# Altium schematic sheet 3_MCU.SchDoc
size B; SheetNumber: 3; SheetTotal: 6
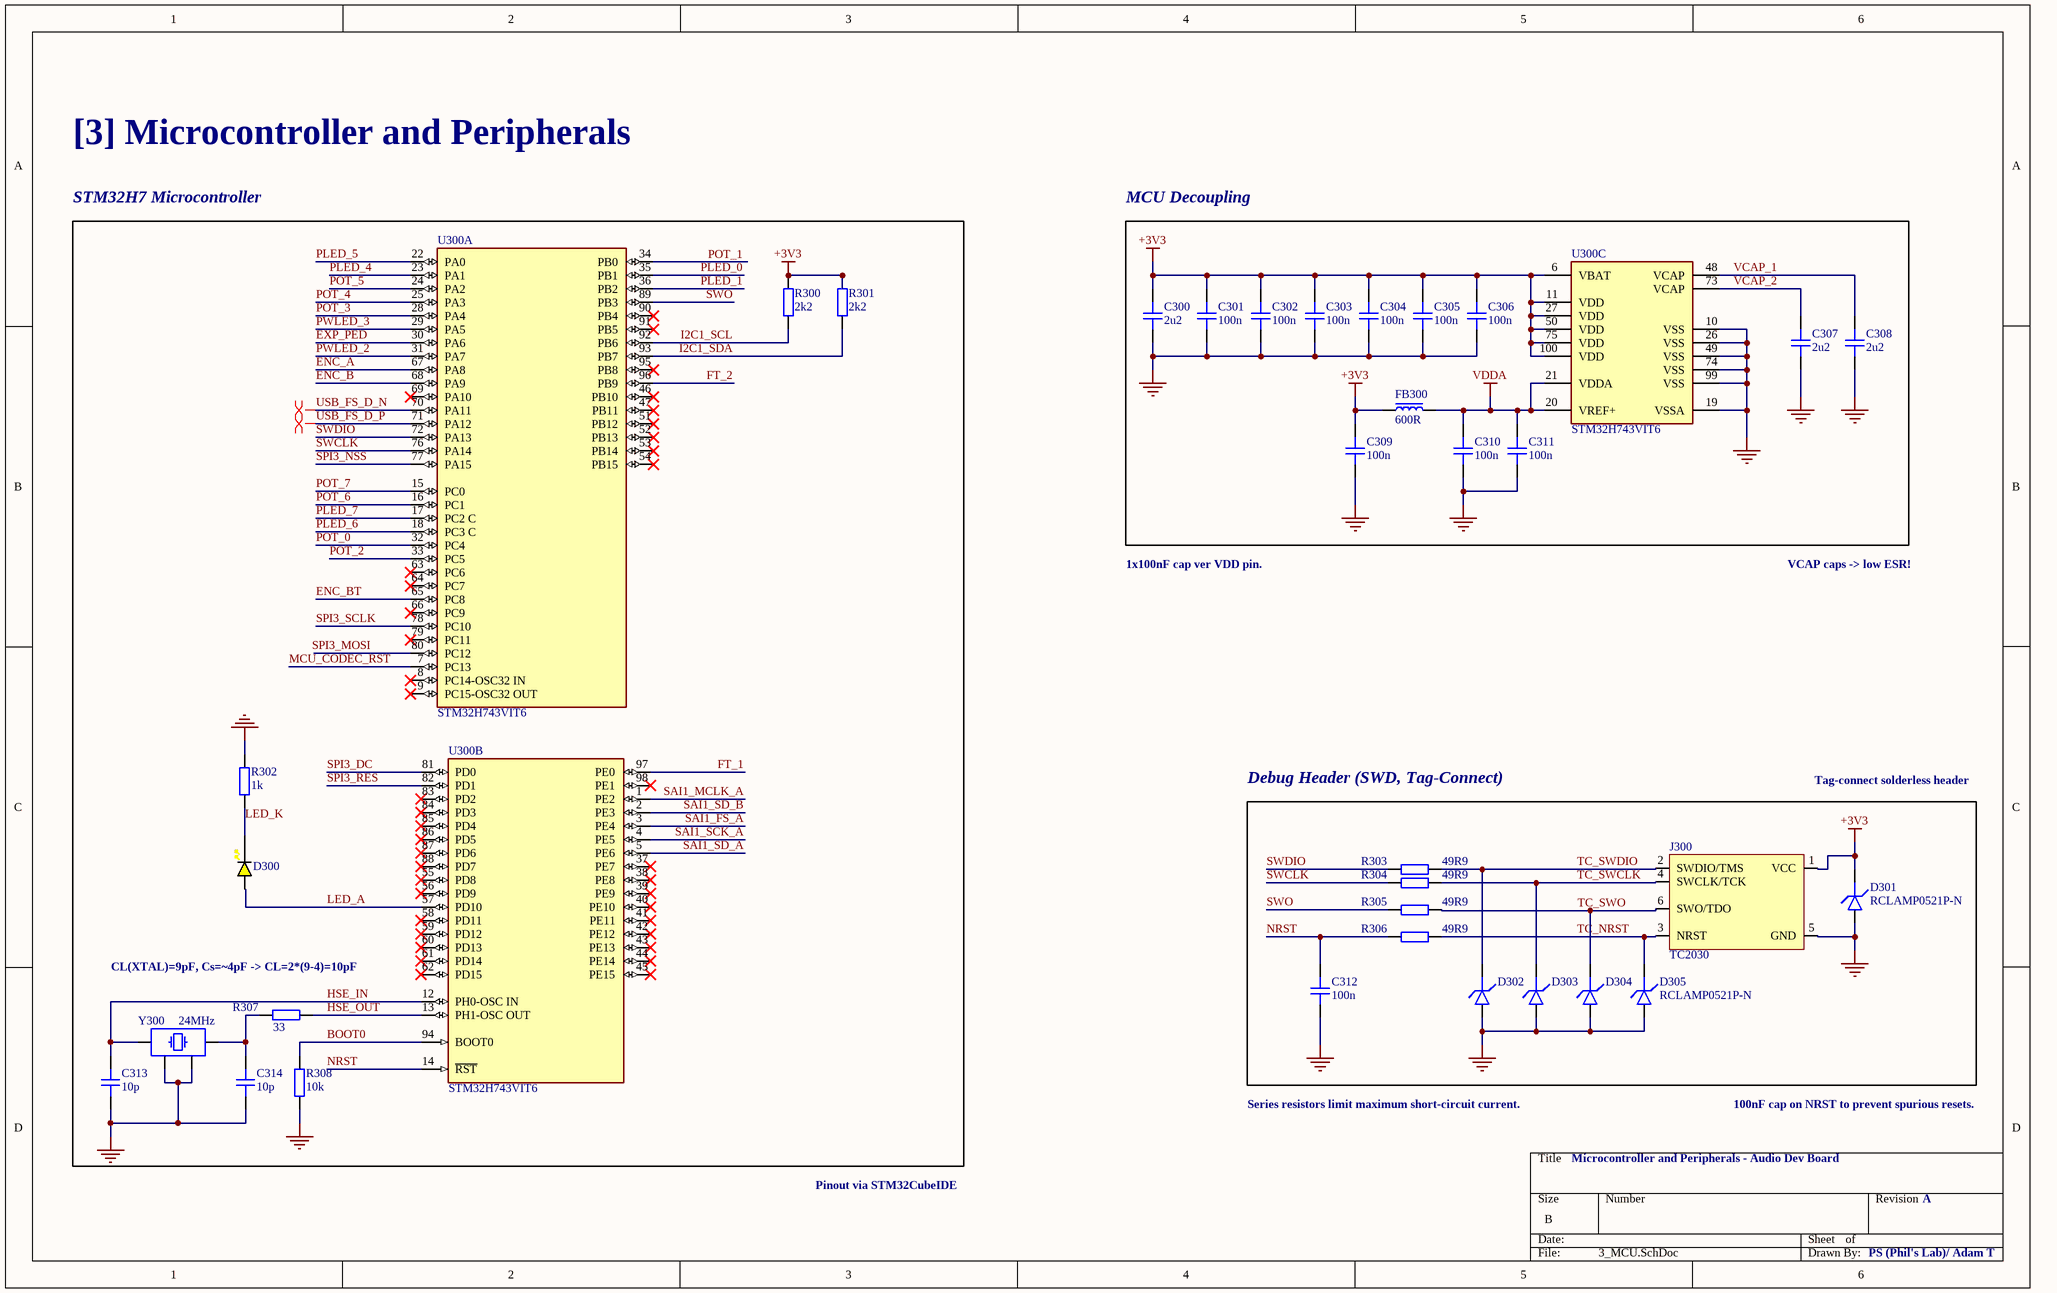
[diagram p0: 3_MCU.SchDoc]

## Parts
C300  2u2  [CAP_0603]
C301  100n  [CAP_0402]
C302  100n  [CAP_0402]
C303  100n  [CAP_0402]
C304  100n  [CAP_0402]
C305  100n  [CAP_0402]
C306  100n  [CAP_0402]
C307  2u2  [CAP_0402]
C308  2u2  [CAP_0402]
C309  100n  [CAP_0402]
C310  100n  [CAP_0402]
C311  100n  [CAP_0402]
C312  100n  [CAP_0402]
C313  10p  [CAP_0402]
C314  10p  [CAP_0402]
D300  YELLOW  [LED_0402_YELLOW]  (value not drawn)
D301  RCLAMP0521P-N  [D_0402]
D302  RCLAMP0521P-N  [D_0402]  (value not drawn)
D303  RCLAMP0521P-N  [D_0402]  (value not drawn)
D304  RCLAMP0521P-N  [D_0402]  (value not drawn)
D305  RCLAMP0521P-N  [D_0402]
FB300  600R  [FB_0805]
J300  TC2030  [TC2030-FP]  (no BOM)
R300  2k2  [RES_0402]
R301  2k2  [RES_0402]
R302  1k  [RES_0402]
R303  49R9  [RES_0402]
R304  49R9  [RES_0402]
R305  49R9  [RES_0402]
R306  49R9  [RES_0402]
R307  33  [RES_0402]
R308  10k  [RES_0402]
U300  STM32H743VIT6  [FP-LQFP100-1L-MFG]  (parts A,B,C of 3)
Y300  24MHz  [XTAL_3225]

## Blocks framed on the sheet
STM32H7 Microcontroller: C313 C314 D300 R300-R302 R307 R308 U300 Y300
MCU Decoupling: C300-C311 FB300 U300
Debug Header (SWD, Tag-Connect): C312 D301-D305 J300 R303-R306

## Nets
+3V3: C300.2 C301.2 C302.2 C303.2 C304.2 C305.2 C306.2 C309.2 D301.K FB300.1 J300.1(VCC) R300.2 R301.2 U300.6(VBAT) U300.11(VDD) U300.27(VDD) U300.50(VDD) U300.75(VDD) U300.100(VDD)
GND: C300.1 C301.1 C302.1 C303.1 C304.1 C305.1 C306.1 C307.1 C308.1 C309.1 C310.1 C311.1 C312.1 C313.1 C314.1 D301.A D302.A D303.A D304.A D305.A J300.5(GND) R302.1 R308.1 U300.10(VSS) U300.19(VSSA) U300.26(VSS) U300.49(VSS) U300.74(VSS) U300.99(VSS) Y300.2 Y300.4
VDDA: C310.2 C311.2 FB300.2 U300.20(VREF+) U300.21(VDDA)
BOOT0: R308.2 U300.94(BOOT0)
ENC_A: U300.67(PA8)
ENC_B: U300.68(PA9)
ENC_BT: U300.65(PC8)
EXP_PED: U300.30(PA6)
FT_1: U300.97(PE0)
FT_2: U300.96(PB9)
HSE_IN: C313.2 U300.12(PH0-OSC_IN) Y300.1
HSE_OUT: R307.2 U300.13(PH1-OSC_OUT)
I2C1_SCL: R300.1 U300.92(PB6)
I2C1_SDA: R301.1 U300.93(PB7)
LED_A: D300.A U300.57(PD10)
LED_K: D300.K R302.2
MCU_CODEC_RST: U300.7(PC13)
NRST: C312.2 R306.1 U300.14(~{RST})
PLED_0: U300.35(PB1)
PLED_1: U300.36(PB2)
PLED_4: U300.23(PA1)
PLED_5: U300.22(PA0)
PLED_6: U300.18(PC3_C)
PLED_7: U300.17(PC2_C)
POT_0: U300.32(PC4)
POT_1: U300.34(PB0)
POT_2: U300.33(PC5)
POT_3: U300.28(PA4)
POT_4: U300.25(PA3)
POT_5: U300.24(PA2)
POT_6: U300.16(PC1)
POT_7: U300.15(PC0)
PWLED_2: U300.31(PA7)
PWLED_3: U300.29(PA5)
SAI1_FS_A: U300.3(PE4)
SAI1_MCLK_A: U300.1(PE2)
SAI1_SCK_A: U300.4(PE5)
SAI1_SD_A: U300.5(PE6)
SAI1_SD_B: U300.2(PE3)
SPI3_DC: U300.81(PD0)
SPI3_MOSI: U300.80(PC12)
SPI3_NSS: U300.77(PA15)
SPI3_RES: U300.82(PD1)
SPI3_SCLK: U300.78(PC10)
SWCLK: R304.1 U300.76(PA14)
SWDIO: R303.1 U300.72(PA13)
SWO: R305.1 U300.89(PB3)
TC_NRST: D305.K J300.3(NRST) R306.2
TC_SWCLK: D303.K J300.4(SWCLK/TCK) R304.2
TC_SWDIO: D302.K J300.2(SWDIO/TMS) R303.2
TC_SWO: D304.K J300.6(SWO/TDO) R305.2
USB_FS_D_N: U300.70(PA11)
USB_FS_D_P: U300.71(PA12)
VCAP_1: C308.2 U300.48(VCAP)
VCAP_2: C307.2 U300.73(VCAP)
NetC314_2: C314.2 R307.1 Y300.3

Not connected (* = marked no-connect by the designer): U300 8(PC14-OSC32_IN)* 9(PC15-OSC32_OUT)* 37(PE7)* 38(PE8)* 39(PE9)* 40(PE10)* 41(PE11)* 42(PE12)* 43(PE13)* 44(PE14)* 45(PE15)* 46(PB10)* 47(PB11)* 51(PB12)* 52(PB13)* 53(PB14)* 54(PB15)* 55(PD8)* 56(PD9)* 58(PD11)* 59(PD12)* 60(PD13)* 61(PD14)* 62(PD15)* 63(PC6)* 64(PC7)* 66(PC9)* 69(PA10)* 79(PC11)* 83(PD2)* 84(PD3)* 85(PD4)* 86(PD5)* 87(PD6)* 88(PD7)* 90(PB4)* 91(PB5)* 95(PB8)* 98(PE1)*

## Layout directives
differential pair; differential pair class DIFF_USB: USB_FS_D_N, USB_FS_D_P

## Notes on the sheet
- [3] Microcontroller and Peripherals
- 1x100nF cap ver VDD pin.
- VCAP caps -> low ESR!
- Tag-connect solderless header
- (near R307) CL(XTAL)=9pF, Cs=~4pF -> CL=2*(9-4)=10pF
- Series resistors limit maximum short-circuit current.
- 100nF cap on NRST to prevent spurious resets.
- Microcontroller and Peripherals - Audio Dev Board
- Pinout via STM32CubeIDE
- A
- PS (Phil's Lab)/ Adam T

## Library data of the parts
C300 = CAP_0603_16V: Capacitor SMD 0603 16V
C301-C312 = CAP_0402: Capacitor SMD 0402; Manufacturer: *; Manufacturer Part Number: *; Distributor Link: *; LCSC: *; Rating: *; Dielectric: *
C313 C314 = CAP_0402_16V: Capacitor SMD 0402 16V
D300 = LED_0402_YELLOW: LED 0402 YELLOW SMD
D301-D305 = D_TVS_0402: Diode TVS / ESD 0402
FB300 = FB_0805: Ferrite Bead SMD 0805 C2982098; Manufacturer: *; Manufacturer Part Number: *; Distributor Link: *; LCSC: *
J300 = TC2030: Tag-Connect No-Solder SWD Debug Connector DO NOT PLACE; Manufacturer: Tag-Connect; Manufacturer Part Number: TC2030
R300-R308 = RES_0402: Resistor SMD 0402
U300 = CMP-12105-000050-1: IC MCU 32BIT 2MB FLASH 100LQFP; Manufacturer: STMicroelectronics; Number Of Ethernet Channels: 1; Number Of Usb Channels: 2; Number Of A/D Converters: 3; Min Supply Voltage: 1.71V; Ram Size: 1060KBytes; Number Of I2C Channels: 4; Frequency: 480MHz; Number Of Adc Channels: 36; Number Of I/Os: 82; Max Supply Voltage: 3.6V; Number Of Spi Channels: 6; Memory Size: 2MBytes; Max Junction Temp: +125°C; Core Architecture: Arm Cortex-M7; Interface: I2C,SPI,UART,USART,USB,LIN,IrDA,Ethernet,I2S,Other; Number Of Timers/Counters: 20; Data Bus Width: 32bits; Number Of Pwm Channels: 42; Number Of Uart Channels: 9; Standoff Height: 0.05mm; Device Class L1: Integrated Circuits (ICs); ComponentLink2URL: https://www.st.com/resource/en/datasheet/stm32h743vi.pdf; Automotive: No; Memory Type: FLASH; Number Of Cores: 1; Temperature Range Low: -40°C; RoHS: TRUE; Ambient Temperature Range Low: -40°C; ComponentLink2Description: Datasheet; Device Class L2: Embedded Processors and Controllers; Device Class L3: Microcontrollers; Digikey Description: IC MCU 32BIT 2MB FLASH 100LQFP; Temperature Range High: +125°C; Ambient Temperature Range High: +85°C; Package: LQFP100-1L; Temperature: -40°C to +125°C; Category: IC; Ipc Land Pattern Name: QFP50P1600X1600X160-100; Height: 1.6mm; Manufacturer Part Number: STM32H743VIT6; Octopart: https://octopart.com/stm32h743vit6-stmicroelectronics-76372527; Lead Free: Yes
Y300 = TSX-3225_24.0000MF15X-AC: Crystal SMD 24MHz 10PPM 7pF 3225; Manufacturer: Epson; Manufacturer Number: TSX-3225 24.0000MF15X-AC; ESR: 40R; Value: 24MHz; Type: XTAL; Load Capacitance: 7pF